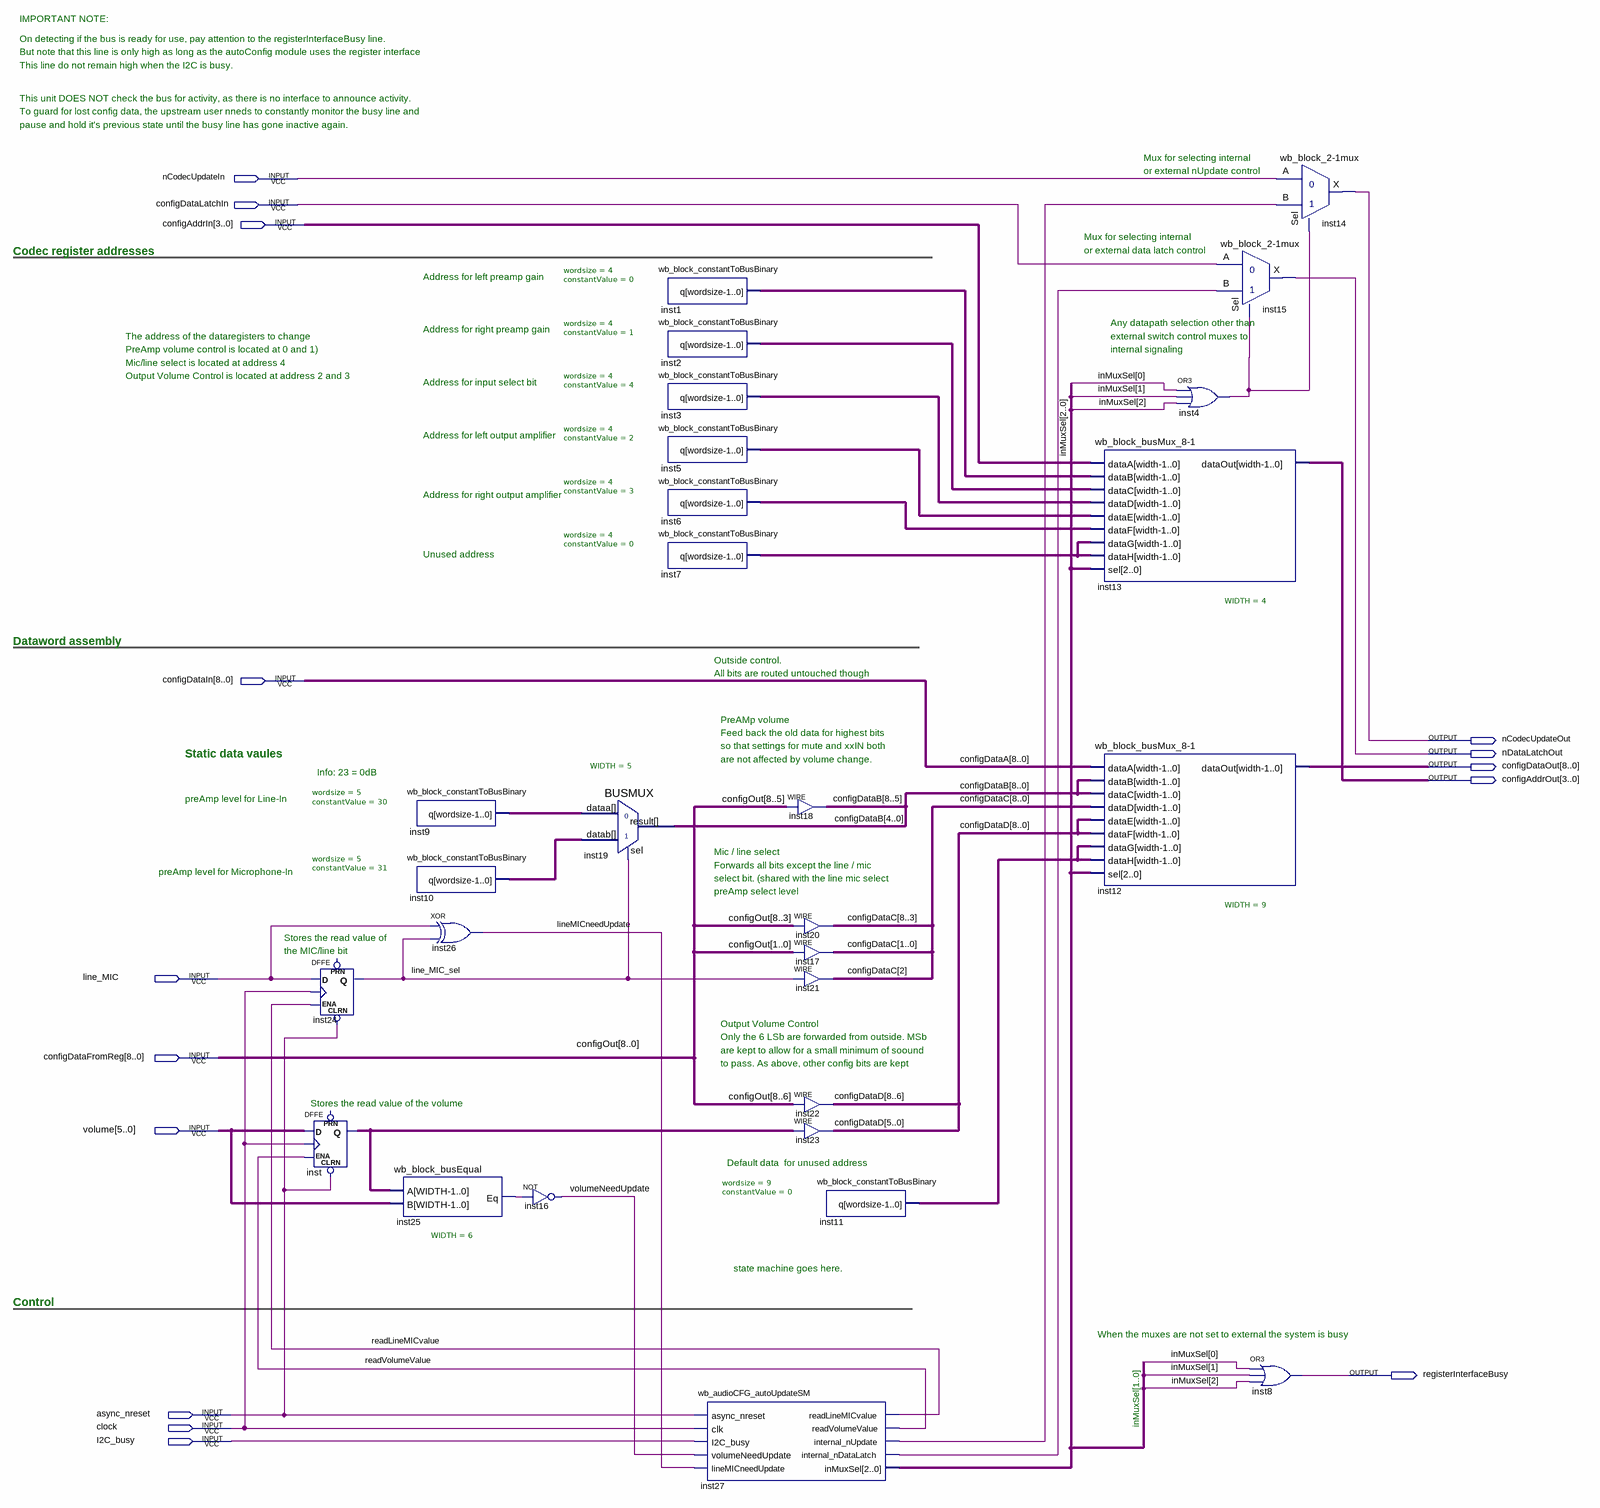
[diagram p0: schematic sheet]
// Quartus schematic wb_audioCFG_autoUpdate.bdf as structural Verilog: 28 symbols, 15 pins
module wb_audioCFG_autoUpdate (
  input  nCodecUpdateIn,
  input  configDataLatchIn,
  input  [3:0] configAddrIn,
  input  [8:0] configDataIn,
  input  line_MIC,
  input  [8:0] configDataFromReg,
  input  [5:0] volume,
  input  async_nreset,
  input  clock,
  input  I2C_busy,
  output nCodecUpdateOut,
  output nDataLatchOut,
  output [8:0] configDataOut,
  output [3:0] configAddrOut,
  output registerInterfaceBusy
);

  wire inst4_out, inst25_eq, inst27_internal_ndatalatch, inst27_internal_nupdate, line_MIC_sel,
       lineMICneedUpdate, readLineMICvalue, readVolumeValue, volumeNeedUpdate;
  wire [2:0] inMuxSel;
  wire [3:0] inst1_q, inst2_q, inst3_q, inst5_q, inst6_q, inst7_q;
  wire [4:0] inst9_q, inst10_q;
  wire [5:0] inst_q;
  wire [8:0] configDataB, configDataC, configDataD, inst11_q;

  DFFE inst24 (.CLRN(async_nreset), .D(line_MIC), .CLK(clock), .ENA(readLineMICvalue), .Q(line_MIC_sel));  // open: PRN
  DFFE inst[5:0] (.CLRN(async_nreset), .D(volume), .CLK(clock), .ENA(readVolumeValue), .Q(inst_q));  // open: PRN
  wb_block_constantToBusBinary #(.wordsize(5), .constantValue(30)) inst9 (.q(inst9_q));
  wb_block_constantToBusBinary #(.wordsize(5), .constantValue(31)) inst10 (.q(inst10_q));
  wb_block_busEqual #(.WIDTH(6)) inst25 (.A(inst_q), .B(volume), .Eq(inst25_eq));
  xor inst26 (lineMICneedUpdate, line_MIC, line_MIC_sel);
  not inst16 (volumeNeedUpdate, inst25_eq);
  BUSMUX #(.WIDTH(5)) inst19 (.datab(inst10_q), .sel(line_MIC_sel), .dataa(inst9_q), .result(configDataB[4:0]));
  wb_block_constantToBusBinary #(.wordsize(4), .constantValue(0)) inst1 (.q(inst1_q));
  wb_block_constantToBusBinary #(.wordsize(4), .constantValue(1)) inst2 (.q(inst2_q));
  wb_block_constantToBusBinary #(.wordsize(4), .constantValue(4)) inst3 (.q(inst3_q));
  wb_block_constantToBusBinary #(.wordsize(4), .constantValue(2)) inst5 (.q(inst5_q));
  wb_block_constantToBusBinary #(.wordsize(4), .constantValue(3)) inst6 (.q(inst6_q));
  wb_block_constantToBusBinary #(.wordsize(4), .constantValue(0)) inst7 (.q(inst7_q));
  wb_audioCFG_autoUpdateSM inst27 (
    .async_nreset(async_nreset), .clk(clock), .I2C_busy(I2C_busy), .volumeNeedUpdate(volumeNeedUpdate),
    .lineMICneedUpdate(lineMICneedUpdate), .readLineMICvalue(readLineMICvalue),
    .readVolumeValue(readVolumeValue), .internal_nUpdate(inst27_internal_nupdate),
    .internal_nDataLatch(inst27_internal_ndatalatch), .inMuxSel(inMuxSel));
  assign configDataB[8:5] = configDataFromReg[8:5];  // WIRE inst18
  assign configDataC[8:3] = configDataFromReg[8:3];  // WIRE inst20
  assign configDataC[1:0] = configDataFromReg[1:0];  // WIRE inst17
  assign configDataC[2] = line_MIC_sel;  // WIRE inst21
  assign configDataD[8:6] = configDataFromReg[8:6];  // WIRE inst22
  assign configDataD[5:0] = inst_q;  // WIRE inst23
  wb_block_constantToBusBinary #(.wordsize(9), .constantValue(0)) inst11 (.q(inst11_q));
  \wb_block_busMux_8-1  #(.WIDTH(4)) inst13 (
    .dataA(configAddrIn), .dataB(inst1_q), .dataC(inst2_q), .dataD(inst3_q), .dataE(inst5_q),
    .dataF(inst6_q), .dataG(inst7_q), .dataH(inst7_q), .sel(inMuxSel), .dataOut(configAddrOut));
  \wb_block_busMux_8-1  #(.WIDTH(9)) inst12 (
    .dataA(configDataIn), .dataB(configDataB), .dataC(configDataB), .dataD(configDataC), .dataE(configDataD),
    .dataF(configDataD), .dataG(inst11_q), .dataH(inst11_q), .sel(inMuxSel), .dataOut(configDataOut));
  \wb_block_2-1mux  inst15 (.A(configDataLatchIn), .Sel(inst4_out), .B(inst27_internal_ndatalatch), .X(nDataLatchOut));
  or inst4 (inst4_out, inMuxSel[0], inMuxSel[1], inMuxSel[2]);
  or inst8 (registerInterfaceBusy, inMuxSel[0], inMuxSel[1], inMuxSel[2]);
  \wb_block_2-1mux  inst14 (.A(nCodecUpdateIn), .Sel(inst4_out), .B(inst27_internal_nupdate), .X(nCodecUpdateOut));

  // Other names for the same wires on the sheet: configDataA[8:0] = configDataIn; configOut[8:0] = configDataFromReg

  // Notes on the sheet:
  //   IMPORTANT NOTE:
  //   On detecting if the bus is ready for use, pay attention to the registerInterfaceBusy line.
  //   But note that this line is only high as long as the autoConfig module uses the register interface
  //   This line do not remain high when the I2C is busy.
  //   This unit DOES NOT check the bus for activity, as there is no interface to announce activity.
  //   To guard for lost config data, the upstream user nneds to constantly monitor the busy line and
  //   pause and hold it's previous state until the busy line has gone inactive again.
  //   Mux for selecting internal
  //   or external nUpdate control
  //   Mux for selecting internal
  //   Codec register addresses
  //   or external data latch control
  //   Address for left preamp gain
  //   Any datapath selection other than
  //   Address for right preamp gain
  //   The address of the dataregisters to change
  //   external switch control muxes to
  //   PreAmp volume control is located at 0 and 1)
  //   internal signaling
  //   Mic/line select is located at address 4
  //   Output Volume Control is located at address 2 and 3
  //   Address for input select bit
  //   Address for left output amplifier
  //   Address for right output amplifier
  //   Unused address
  //   Dataword assembly
  //   Outside control.
  //   All bits are routed untouched though
  //   PreAMp volume
  //   Feed back the old data for highest bits
  //   so that settings for mute and xxIN both
  //   Static data vaules
  //   are not affected by volume change.
  //   Info: 23 = 0dB
  //   preAmp level for Line-In
  //   Mic / line select
  //   Forwards all bits except the line / mic
  //   preAmp level for Microphone-In
  //   select bit. (shared with the line mic select
  //   preAmp select level
  //   Stores the read value of
  //   the MIC/line bit
  //   Output Volume Control
  //   Only the 6 LSb are forwarded from outside. MSb
  //   are kept to allow for a small minimum of soound
  //   to pass. As above, other config bits are kept
  //   Stores the read value of the volume
  //   Default data  for unused address
  //   state machine goes here.
  //   Control
  //   When the muxes are not set to external the system is busy
  //   inMuxSel[1..0]
endmodule
